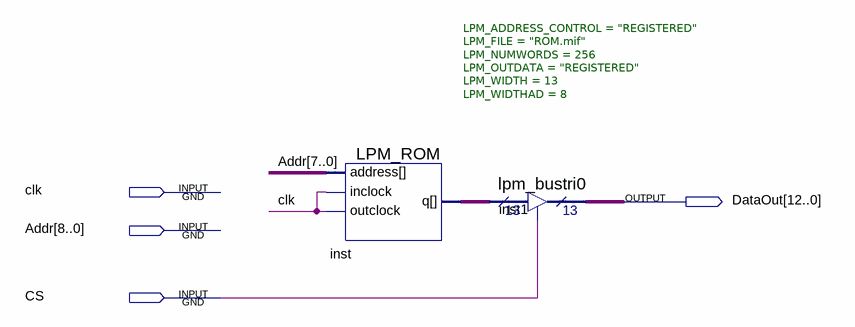
[diagram p0: schematic sheet]
// Quartus schematic ROM.bdf as structural Verilog: 2 symbols, 4 pins
module ROM (
  input  clk,
  input  [8:0] Addr,
  input  CS,
  output [12:0] DataOut
);

  wire [12:0] inst_q;

  LPM_ROM #(.LPM_ADDRESS_CONTROL("REGISTERED"), .LPM_FILE("ROM.mif"), .LPM_NUMWORDS(256), .LPM_OUTDATA("REGISTERED"), .LPM_WIDTH(13), .LPM_WIDTHAD(8)) inst (
    .address(Addr[7:0]), .inclock(clk), .outclock(clk), .q(inst_q));
  lpm_bustri0 inst1 (.enabledt(CS), .data(inst_q), .tridata(DataOut));
endmodule
